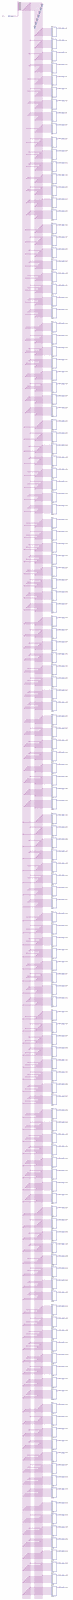
[diagram p0: schematic sheet, whole]
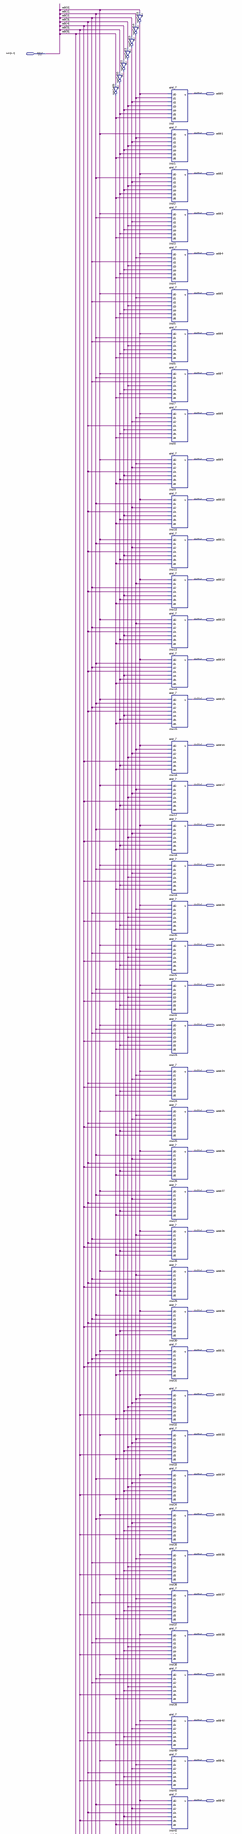
[diagram p1: schematic sheet, upper part]
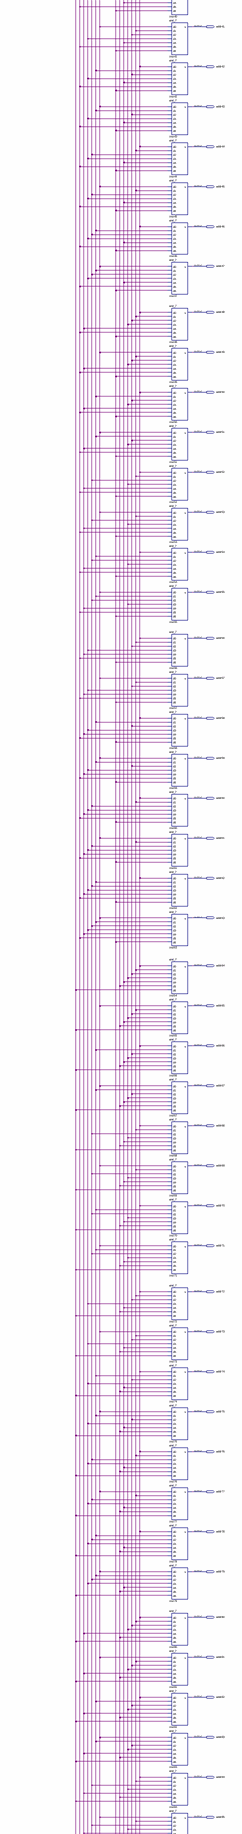
[diagram p2: schematic sheet, middle part]
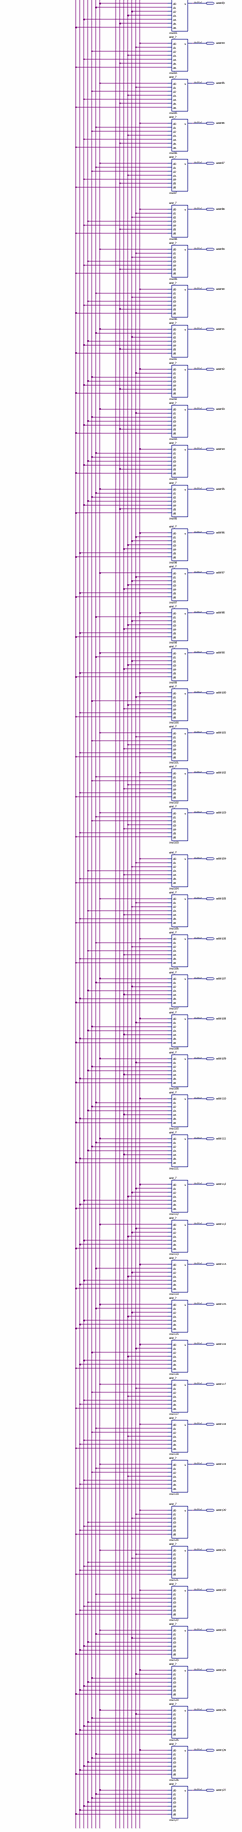
[diagram p3: schematic sheet, lower part]
// Quartus schematic ymq7.bdf as structural Verilog: 135 symbols, 129 pins
module ymq7 (
  input  [6:0] adr,
  output addr0,
  output addr1,
  output addr2,
  output addr3,
  output addr4,
  output addr5,
  output addr6,
  output addr7,
  output addr8,
  output addr9,
  output addr10,
  output addr11,
  output addr12,
  output addr13,
  output addr14,
  output addr15,
  output addr16,
  output addr17,
  output addr18,
  output addr19,
  output addr20,
  output addr21,
  output addr22,
  output addr23,
  output addr24,
  output addr25,
  output addr26,
  output addr27,
  output addr28,
  output addr29,
  output addr30,
  output addr31,
  output addr32,
  output addr33,
  output addr34,
  output addr35,
  output addr36,
  output addr37,
  output addr38,
  output addr39,
  output addr40,
  output addr41,
  output addr42,
  output addr43,
  output addr44,
  output addr45,
  output addr46,
  output addr47,
  output addr48,
  output addr49,
  output addr50,
  output addr51,
  output addr52,
  output addr53,
  output addr54,
  output addr55,
  output addr56,
  output addr57,
  output addr58,
  output addr59,
  output addr60,
  output addr61,
  output addr62,
  output addr63,
  output addr64,
  output addr65,
  output addr66,
  output addr67,
  output addr68,
  output addr69,
  output addr70,
  output addr71,
  output addr72,
  output addr73,
  output addr74,
  output addr75,
  output addr76,
  output addr77,
  output addr78,
  output addr79,
  output addr80,
  output addr81,
  output addr82,
  output addr83,
  output addr84,
  output addr85,
  output addr86,
  output addr87,
  output addr88,
  output addr89,
  output addr90,
  output addr91,
  output addr92,
  output addr93,
  output addr94,
  output addr95,
  output addr96,
  output addr97,
  output addr98,
  output addr99,
  output addr100,
  output addr101,
  output addr102,
  output addr103,
  output addr104,
  output addr105,
  output addr106,
  output addr107,
  output addr108,
  output addr109,
  output addr110,
  output addr111,
  output addr112,
  output addr113,
  output addr114,
  output addr115,
  output addr116,
  output addr117,
  output addr118,
  output addr119,
  output addr120,
  output addr121,
  output addr122,
  output addr123,
  output addr124,
  output addr125,
  output addr126,
  output addr127
);

  wire inst1409_out, inst1410_out, inst1411_out, inst1412_out, inst1413_out, inst1414_out, inst1415_out;

  not inst1410 (inst1410_out, adr[5]);
  not inst1409 (inst1409_out, adr[6]);
  not inst1414 (inst1414_out, adr[1]);
  not inst1413 (inst1413_out, adr[2]);
  not inst1412 (inst1412_out, adr[3]);
  not inst1411 (inst1411_out, adr[4]);
  not inst1415 (inst1415_out, adr[0]);
  and_7 inst (
    .d0(inst1415_out), .d1(inst1414_out), .d2(inst1413_out), .d3(inst1412_out), .d4(inst1411_out),
    .d5(inst1410_out), .d6(inst1409_out), .s(addr0));
  and_7 inst1 (
    .d0(adr[0]), .d1(inst1414_out), .d2(inst1413_out), .d3(inst1412_out), .d4(inst1411_out),
    .d5(inst1410_out), .d6(inst1409_out), .s(addr1));
  and_7 inst2 (
    .d0(inst1415_out), .d1(adr[1]), .d2(inst1413_out), .d3(inst1412_out), .d4(inst1411_out),
    .d5(inst1410_out), .d6(inst1409_out), .s(addr2));
  and_7 inst3 (
    .d0(adr[0]), .d1(adr[1]), .d2(inst1413_out), .d3(inst1412_out), .d4(inst1411_out), .d5(inst1410_out),
    .d6(inst1409_out), .s(addr3));
  and_7 inst4 (
    .d0(inst1415_out), .d1(inst1414_out), .d2(adr[2]), .d3(inst1412_out), .d4(inst1411_out),
    .d5(inst1410_out), .d6(inst1409_out), .s(addr4));
  and_7 inst5 (
    .d0(adr[0]), .d1(inst1414_out), .d2(adr[2]), .d3(inst1412_out), .d4(inst1411_out), .d5(inst1410_out),
    .d6(inst1409_out), .s(addr5));
  and_7 inst6 (
    .d0(inst1415_out), .d1(adr[1]), .d2(adr[2]), .d3(inst1412_out), .d4(inst1411_out), .d5(inst1410_out),
    .d6(inst1409_out), .s(addr6));
  and_7 inst7 (
    .d0(adr[0]), .d1(adr[1]), .d2(adr[2]), .d3(inst1412_out), .d4(inst1411_out), .d5(inst1410_out),
    .d6(inst1409_out), .s(addr7));
  and_7 inst8 (
    .d0(inst1415_out), .d1(inst1414_out), .d2(inst1413_out), .d3(adr[3]), .d4(inst1411_out),
    .d5(inst1410_out), .d6(inst1409_out), .s(addr8));
  and_7 inst9 (
    .d0(adr[0]), .d1(inst1414_out), .d2(inst1413_out), .d3(adr[3]), .d4(inst1411_out), .d5(inst1410_out),
    .d6(inst1409_out), .s(addr9));
  and_7 inst10 (
    .d0(inst1415_out), .d1(adr[1]), .d2(inst1413_out), .d3(adr[3]), .d4(inst1411_out), .d5(inst1410_out),
    .d6(inst1409_out), .s(addr10));
  and_7 inst11 (
    .d0(adr[0]), .d1(adr[1]), .d2(inst1413_out), .d3(adr[3]), .d4(inst1411_out), .d5(inst1410_out),
    .d6(inst1409_out), .s(addr11));
  and_7 inst12 (
    .d0(inst1415_out), .d1(inst1414_out), .d2(adr[2]), .d3(adr[3]), .d4(inst1411_out), .d5(inst1410_out),
    .d6(inst1409_out), .s(addr12));
  and_7 inst13 (
    .d0(adr[0]), .d1(inst1414_out), .d2(adr[2]), .d3(adr[3]), .d4(inst1411_out), .d5(inst1410_out),
    .d6(inst1409_out), .s(addr13));
  and_7 inst14 (
    .d0(inst1415_out), .d1(adr[1]), .d2(adr[2]), .d3(adr[3]), .d4(inst1411_out), .d5(inst1410_out),
    .d6(inst1409_out), .s(addr14));
  and_7 inst15 (
    .d0(adr[0]), .d1(adr[1]), .d2(adr[2]), .d3(adr[3]), .d4(inst1411_out), .d5(inst1410_out),
    .d6(inst1409_out), .s(addr15));
  and_7 inst16 (
    .d0(inst1415_out), .d1(inst1414_out), .d2(inst1413_out), .d3(inst1412_out), .d4(adr[4]),
    .d5(inst1410_out), .d6(inst1409_out), .s(addr16));
  and_7 inst17 (
    .d0(adr[0]), .d1(inst1414_out), .d2(inst1413_out), .d3(inst1412_out), .d4(adr[4]), .d5(inst1410_out),
    .d6(inst1409_out), .s(addr17));
  and_7 inst18 (
    .d0(inst1415_out), .d1(adr[1]), .d2(inst1413_out), .d3(inst1412_out), .d4(adr[4]), .d5(inst1410_out),
    .d6(inst1409_out), .s(addr18));
  and_7 inst19 (
    .d0(adr[0]), .d1(adr[1]), .d2(inst1413_out), .d3(inst1412_out), .d4(adr[4]), .d5(inst1410_out),
    .d6(inst1409_out), .s(addr19));
  and_7 inst20 (
    .d0(inst1415_out), .d1(inst1414_out), .d2(adr[2]), .d3(inst1412_out), .d4(adr[4]), .d5(inst1410_out),
    .d6(inst1409_out), .s(addr20));
  and_7 inst21 (
    .d0(adr[0]), .d1(inst1414_out), .d2(adr[2]), .d3(inst1412_out), .d4(adr[4]), .d5(inst1410_out),
    .d6(inst1409_out), .s(addr21));
  and_7 inst22 (
    .d0(inst1415_out), .d1(adr[1]), .d2(adr[2]), .d3(inst1412_out), .d4(adr[4]), .d5(inst1410_out),
    .d6(inst1409_out), .s(addr22));
  and_7 inst23 (
    .d0(adr[0]), .d1(adr[1]), .d2(adr[2]), .d3(inst1412_out), .d4(adr[4]), .d5(inst1410_out),
    .d6(inst1409_out), .s(addr23));
  and_7 inst24 (
    .d0(inst1415_out), .d1(inst1414_out), .d2(inst1413_out), .d3(adr[3]), .d4(adr[4]), .d5(inst1410_out),
    .d6(inst1409_out), .s(addr24));
  and_7 inst25 (
    .d0(adr[0]), .d1(inst1414_out), .d2(inst1413_out), .d3(adr[3]), .d4(adr[4]), .d5(inst1410_out),
    .d6(inst1409_out), .s(addr25));
  and_7 inst26 (
    .d0(inst1415_out), .d1(adr[1]), .d2(inst1413_out), .d3(adr[3]), .d4(adr[4]), .d5(inst1410_out),
    .d6(inst1409_out), .s(addr26));
  and_7 inst27 (
    .d0(adr[0]), .d1(adr[1]), .d2(inst1413_out), .d3(adr[3]), .d4(adr[4]), .d5(inst1410_out),
    .d6(inst1409_out), .s(addr27));
  and_7 inst28 (
    .d0(inst1415_out), .d1(inst1414_out), .d2(adr[2]), .d3(adr[3]), .d4(adr[4]), .d5(inst1410_out),
    .d6(inst1409_out), .s(addr28));
  and_7 inst29 (
    .d0(adr[0]), .d1(inst1414_out), .d2(adr[2]), .d3(adr[3]), .d4(adr[4]), .d5(inst1410_out),
    .d6(inst1409_out), .s(addr29));
  and_7 inst30 (
    .d0(inst1415_out), .d1(adr[1]), .d2(adr[2]), .d3(adr[3]), .d4(adr[4]), .d5(inst1410_out),
    .d6(inst1409_out), .s(addr30));
  and_7 inst31 (
    .d0(adr[0]), .d1(adr[1]), .d2(adr[2]), .d3(adr[3]), .d4(adr[4]), .d5(inst1410_out), .d6(inst1409_out),
    .s(addr31));
  and_7 inst32 (
    .d0(inst1415_out), .d1(inst1414_out), .d2(inst1413_out), .d3(inst1412_out), .d4(inst1411_out),
    .d5(adr[5]), .d6(inst1409_out), .s(addr32));
  and_7 inst33 (
    .d0(adr[0]), .d1(inst1414_out), .d2(inst1413_out), .d3(inst1412_out), .d4(inst1411_out), .d5(adr[5]),
    .d6(inst1409_out), .s(addr33));
  and_7 inst34 (
    .d0(inst1415_out), .d1(adr[1]), .d2(inst1413_out), .d3(inst1412_out), .d4(inst1411_out), .d5(adr[5]),
    .d6(inst1409_out), .s(addr34));
  and_7 inst35 (
    .d0(adr[0]), .d1(adr[1]), .d2(inst1413_out), .d3(inst1412_out), .d4(inst1411_out), .d5(adr[5]),
    .d6(inst1409_out), .s(addr35));
  and_7 inst36 (
    .d0(inst1415_out), .d1(inst1414_out), .d2(adr[2]), .d3(inst1412_out), .d4(inst1411_out), .d5(adr[5]),
    .d6(inst1409_out), .s(addr36));
  and_7 inst37 (
    .d0(adr[0]), .d1(inst1414_out), .d2(adr[2]), .d3(inst1412_out), .d4(inst1411_out), .d5(adr[5]),
    .d6(inst1409_out), .s(addr37));
  and_7 inst38 (
    .d0(inst1415_out), .d1(adr[1]), .d2(adr[2]), .d3(inst1412_out), .d4(inst1411_out), .d5(adr[5]),
    .d6(inst1409_out), .s(addr38));
  and_7 inst39 (
    .d0(adr[0]), .d1(adr[1]), .d2(adr[2]), .d3(inst1412_out), .d4(inst1411_out), .d5(adr[5]),
    .d6(inst1409_out), .s(addr39));
  and_7 inst40 (
    .d0(inst1415_out), .d1(inst1414_out), .d2(inst1413_out), .d3(adr[3]), .d4(inst1411_out), .d5(adr[5]),
    .d6(inst1409_out), .s(addr40));
  and_7 inst41 (
    .d0(adr[0]), .d1(inst1414_out), .d2(inst1413_out), .d3(adr[3]), .d4(inst1411_out), .d5(adr[5]),
    .d6(inst1409_out), .s(addr41));
  and_7 inst42 (
    .d0(inst1415_out), .d1(adr[1]), .d2(inst1413_out), .d3(adr[3]), .d4(inst1411_out), .d5(adr[5]),
    .d6(inst1409_out), .s(addr42));
  and_7 inst43 (
    .d0(adr[0]), .d1(adr[1]), .d2(inst1413_out), .d3(adr[3]), .d4(inst1411_out), .d5(adr[5]),
    .d6(inst1409_out), .s(addr43));
  and_7 inst44 (
    .d0(inst1415_out), .d1(inst1414_out), .d2(adr[2]), .d3(adr[3]), .d4(inst1411_out), .d5(adr[5]),
    .d6(inst1409_out), .s(addr44));
  and_7 inst45 (
    .d0(adr[0]), .d1(inst1414_out), .d2(adr[2]), .d3(adr[3]), .d4(inst1411_out), .d5(adr[5]),
    .d6(inst1409_out), .s(addr45));
  and_7 inst46 (
    .d0(inst1415_out), .d1(adr[1]), .d2(adr[2]), .d3(adr[3]), .d4(inst1411_out), .d5(adr[5]),
    .d6(inst1409_out), .s(addr46));
  and_7 inst47 (
    .d0(adr[0]), .d1(adr[1]), .d2(adr[2]), .d3(adr[3]), .d4(inst1411_out), .d5(adr[5]), .d6(inst1409_out),
    .s(addr47));
  and_7 inst48 (
    .d0(inst1415_out), .d1(inst1414_out), .d2(inst1413_out), .d3(inst1412_out), .d4(adr[4]), .d5(adr[5]),
    .d6(inst1409_out), .s(addr48));
  and_7 inst49 (
    .d0(adr[0]), .d1(inst1414_out), .d2(inst1413_out), .d3(inst1412_out), .d4(adr[4]), .d5(adr[5]),
    .d6(inst1409_out), .s(addr49));
  and_7 inst50 (
    .d0(inst1415_out), .d1(adr[1]), .d2(inst1413_out), .d3(inst1412_out), .d4(adr[4]), .d5(adr[5]),
    .d6(inst1409_out), .s(addr50));
  and_7 inst51 (
    .d0(adr[0]), .d1(adr[1]), .d2(inst1413_out), .d3(inst1412_out), .d4(adr[4]), .d5(adr[5]),
    .d6(inst1409_out), .s(addr51));
  and_7 inst52 (
    .d0(inst1415_out), .d1(inst1414_out), .d2(adr[2]), .d3(inst1412_out), .d4(adr[4]), .d5(adr[5]),
    .d6(inst1409_out), .s(addr52));
  and_7 inst53 (
    .d0(adr[0]), .d1(inst1414_out), .d2(adr[2]), .d3(inst1412_out), .d4(adr[4]), .d5(adr[5]),
    .d6(inst1409_out), .s(addr53));
  and_7 inst54 (
    .d0(inst1415_out), .d1(adr[1]), .d2(adr[2]), .d3(inst1412_out), .d4(adr[4]), .d5(adr[5]),
    .d6(inst1409_out), .s(addr54));
  and_7 inst55 (
    .d0(adr[0]), .d1(adr[1]), .d2(adr[2]), .d3(inst1412_out), .d4(adr[4]), .d5(adr[5]), .d6(inst1409_out),
    .s(addr55));
  and_7 inst56 (
    .d0(inst1415_out), .d1(inst1414_out), .d2(inst1413_out), .d3(adr[3]), .d4(adr[4]), .d5(adr[5]),
    .d6(inst1409_out), .s(addr56));
  and_7 inst57 (
    .d0(adr[0]), .d1(inst1414_out), .d2(inst1413_out), .d3(adr[3]), .d4(adr[4]), .d5(adr[5]),
    .d6(inst1409_out), .s(addr57));
  and_7 inst58 (
    .d0(inst1415_out), .d1(adr[1]), .d2(inst1413_out), .d3(adr[3]), .d4(adr[4]), .d5(adr[5]),
    .d6(inst1409_out), .s(addr58));
  and_7 inst59 (
    .d0(adr[0]), .d1(adr[1]), .d2(inst1413_out), .d3(adr[3]), .d4(adr[4]), .d5(adr[5]), .d6(inst1409_out),
    .s(addr59));
  and_7 inst60 (
    .d0(inst1415_out), .d1(inst1414_out), .d2(adr[2]), .d3(adr[3]), .d4(adr[4]), .d5(adr[5]),
    .d6(inst1409_out), .s(addr60));
  and_7 inst61 (
    .d0(adr[0]), .d1(inst1414_out), .d2(adr[2]), .d3(adr[3]), .d4(adr[4]), .d5(adr[5]), .d6(inst1409_out),
    .s(addr61));
  and_7 inst62 (
    .d0(inst1415_out), .d1(adr[1]), .d2(adr[2]), .d3(adr[3]), .d4(adr[4]), .d5(adr[5]), .d6(inst1409_out),
    .s(addr62));
  and_7 inst63 (
    .d0(adr[0]), .d1(adr[1]), .d2(adr[2]), .d3(adr[3]), .d4(adr[4]), .d5(adr[5]), .d6(inst1409_out),
    .s(addr63));
  and_7 inst64 (
    .d0(inst1415_out), .d1(inst1414_out), .d2(inst1413_out), .d3(inst1412_out), .d4(inst1411_out),
    .d5(inst1410_out), .d6(adr[6]), .s(addr64));
  and_7 inst65 (
    .d0(adr[0]), .d1(inst1414_out), .d2(inst1413_out), .d3(inst1412_out), .d4(inst1411_out),
    .d5(inst1410_out), .d6(adr[6]), .s(addr65));
  and_7 inst66 (
    .d0(inst1415_out), .d1(adr[1]), .d2(inst1413_out), .d3(inst1412_out), .d4(inst1411_out),
    .d5(inst1410_out), .d6(adr[6]), .s(addr66));
  and_7 inst67 (
    .d0(adr[0]), .d1(adr[1]), .d2(inst1413_out), .d3(inst1412_out), .d4(inst1411_out), .d5(inst1410_out),
    .d6(adr[6]), .s(addr67));
  and_7 inst68 (
    .d0(inst1415_out), .d1(inst1414_out), .d2(adr[2]), .d3(inst1412_out), .d4(inst1411_out),
    .d5(inst1410_out), .d6(adr[6]), .s(addr68));
  and_7 inst69 (
    .d0(adr[0]), .d1(inst1414_out), .d2(adr[2]), .d3(inst1412_out), .d4(inst1411_out), .d5(inst1410_out),
    .d6(adr[6]), .s(addr69));
  and_7 inst70 (
    .d0(inst1415_out), .d1(adr[1]), .d2(adr[2]), .d3(inst1412_out), .d4(inst1411_out), .d5(inst1410_out),
    .d6(adr[6]), .s(addr70));
  and_7 inst71 (
    .d0(adr[0]), .d1(adr[1]), .d2(adr[2]), .d3(inst1412_out), .d4(inst1411_out), .d5(inst1410_out),
    .d6(adr[6]), .s(addr71));
  and_7 inst72 (
    .d0(inst1415_out), .d1(inst1414_out), .d2(inst1413_out), .d3(adr[3]), .d4(inst1411_out),
    .d5(inst1410_out), .d6(adr[6]), .s(addr72));
  and_7 inst73 (
    .d0(adr[0]), .d1(inst1414_out), .d2(inst1413_out), .d3(adr[3]), .d4(inst1411_out), .d5(inst1410_out),
    .d6(adr[6]), .s(addr73));
  and_7 inst74 (
    .d0(inst1415_out), .d1(adr[1]), .d2(inst1413_out), .d3(adr[3]), .d4(inst1411_out), .d5(inst1410_out),
    .d6(adr[6]), .s(addr74));
  and_7 inst75 (
    .d0(adr[0]), .d1(adr[1]), .d2(inst1413_out), .d3(adr[3]), .d4(inst1411_out), .d5(inst1410_out),
    .d6(adr[6]), .s(addr75));
  and_7 inst76 (
    .d0(inst1415_out), .d1(inst1414_out), .d2(adr[2]), .d3(adr[3]), .d4(inst1411_out), .d5(inst1410_out),
    .d6(adr[6]), .s(addr76));
  and_7 inst77 (
    .d0(adr[0]), .d1(inst1414_out), .d2(adr[2]), .d3(adr[3]), .d4(inst1411_out), .d5(inst1410_out),
    .d6(adr[6]), .s(addr77));
  and_7 inst78 (
    .d0(inst1415_out), .d1(adr[1]), .d2(adr[2]), .d3(adr[3]), .d4(inst1411_out), .d5(inst1410_out),
    .d6(adr[6]), .s(addr78));
  and_7 inst79 (
    .d0(adr[0]), .d1(adr[1]), .d2(adr[2]), .d3(adr[3]), .d4(inst1411_out), .d5(inst1410_out), .d6(adr[6]),
    .s(addr79));
  and_7 inst80 (
    .d0(inst1415_out), .d1(inst1414_out), .d2(inst1413_out), .d3(inst1412_out), .d4(adr[4]),
    .d5(inst1410_out), .d6(adr[6]), .s(addr80));
  and_7 inst81 (
    .d0(adr[0]), .d1(inst1414_out), .d2(inst1413_out), .d3(inst1412_out), .d4(adr[4]), .d5(inst1410_out),
    .d6(adr[6]), .s(addr81));
  and_7 inst82 (
    .d0(inst1415_out), .d1(adr[1]), .d2(inst1413_out), .d3(inst1412_out), .d4(adr[4]), .d5(inst1410_out),
    .d6(adr[6]), .s(addr82));
  and_7 inst83 (
    .d0(adr[0]), .d1(adr[1]), .d2(inst1413_out), .d3(inst1412_out), .d4(adr[4]), .d5(inst1410_out),
    .d6(adr[6]), .s(addr83));
  and_7 inst84 (
    .d0(inst1415_out), .d1(inst1414_out), .d2(adr[2]), .d3(inst1412_out), .d4(adr[4]), .d5(inst1410_out),
    .d6(adr[6]), .s(addr84));
  and_7 inst85 (
    .d0(adr[0]), .d1(inst1414_out), .d2(adr[2]), .d3(inst1412_out), .d4(adr[4]), .d5(inst1410_out),
    .d6(adr[6]), .s(addr85));
  and_7 inst86 (
    .d0(inst1415_out), .d1(adr[1]), .d2(adr[2]), .d3(inst1412_out), .d4(adr[4]), .d5(inst1410_out),
    .d6(adr[6]), .s(addr86));
  and_7 inst87 (
    .d0(adr[0]), .d1(adr[1]), .d2(adr[2]), .d3(inst1412_out), .d4(adr[4]), .d5(inst1410_out), .d6(adr[6]),
    .s(addr87));
  and_7 inst88 (
    .d0(inst1415_out), .d1(inst1414_out), .d2(inst1413_out), .d3(adr[3]), .d4(adr[4]), .d5(inst1410_out),
    .d6(adr[6]), .s(addr88));
  and_7 inst89 (
    .d0(adr[0]), .d1(inst1414_out), .d2(inst1413_out), .d3(adr[3]), .d4(adr[4]), .d5(inst1410_out),
    .d6(adr[6]), .s(addr89));
  and_7 inst90 (
    .d0(inst1415_out), .d1(adr[1]), .d2(inst1413_out), .d3(adr[3]), .d4(adr[4]), .d5(inst1410_out),
    .d6(adr[6]), .s(addr90));
  and_7 inst91 (
    .d0(adr[0]), .d1(adr[1]), .d2(inst1413_out), .d3(adr[3]), .d4(adr[4]), .d5(inst1410_out), .d6(adr[6]),
    .s(addr91));
  and_7 inst92 (
    .d0(inst1415_out), .d1(inst1414_out), .d2(adr[2]), .d3(adr[3]), .d4(adr[4]), .d5(inst1410_out),
    .d6(adr[6]), .s(addr92));
  and_7 inst93 (
    .d0(adr[0]), .d1(inst1414_out), .d2(adr[2]), .d3(adr[3]), .d4(adr[4]), .d5(inst1410_out), .d6(adr[6]),
    .s(addr93));
  and_7 inst94 (
    .d0(inst1415_out), .d1(adr[1]), .d2(adr[2]), .d3(adr[3]), .d4(adr[4]), .d5(inst1410_out), .d6(adr[6]),
    .s(addr94));
  and_7 inst95 (
    .d0(adr[0]), .d1(adr[1]), .d2(adr[2]), .d3(adr[3]), .d4(adr[4]), .d5(inst1410_out), .d6(adr[6]),
    .s(addr95));
  and_7 inst96 (
    .d0(inst1415_out), .d1(inst1414_out), .d2(inst1413_out), .d3(inst1412_out), .d4(inst1411_out),
    .d5(adr[5]), .d6(adr[6]), .s(addr96));
  and_7 inst97 (
    .d0(adr[0]), .d1(inst1414_out), .d2(inst1413_out), .d3(inst1412_out), .d4(inst1411_out), .d5(adr[5]),
    .d6(adr[6]), .s(addr97));
  and_7 inst98 (
    .d0(inst1415_out), .d1(adr[1]), .d2(inst1413_out), .d3(inst1412_out), .d4(inst1411_out), .d5(adr[5]),
    .d6(adr[6]), .s(addr98));
  and_7 inst99 (
    .d0(adr[0]), .d1(adr[1]), .d2(inst1413_out), .d3(inst1412_out), .d4(inst1411_out), .d5(adr[5]),
    .d6(adr[6]), .s(addr99));
  and_7 inst100 (
    .d0(inst1415_out), .d1(inst1414_out), .d2(adr[2]), .d3(inst1412_out), .d4(inst1411_out), .d5(adr[5]),
    .d6(adr[6]), .s(addr100));
  and_7 inst101 (
    .d0(adr[0]), .d1(inst1414_out), .d2(adr[2]), .d3(inst1412_out), .d4(inst1411_out), .d5(adr[5]),
    .d6(adr[6]), .s(addr101));
  and_7 inst102 (
    .d0(inst1415_out), .d1(adr[1]), .d2(adr[2]), .d3(inst1412_out), .d4(inst1411_out), .d5(adr[5]),
    .d6(adr[6]), .s(addr102));
  and_7 inst103 (
    .d0(adr[0]), .d1(adr[1]), .d2(adr[2]), .d3(inst1412_out), .d4(inst1411_out), .d5(adr[5]), .d6(adr[6]),
    .s(addr103));
  and_7 inst104 (
    .d0(inst1415_out), .d1(inst1414_out), .d2(inst1413_out), .d3(adr[3]), .d4(inst1411_out), .d5(adr[5]),
    .d6(adr[6]), .s(addr104));
  and_7 inst105 (
    .d0(adr[0]), .d1(inst1414_out), .d2(inst1413_out), .d3(adr[3]), .d4(inst1411_out), .d5(adr[5]),
    .d6(adr[6]), .s(addr105));
  and_7 inst106 (
    .d0(inst1415_out), .d1(adr[1]), .d2(inst1413_out), .d3(adr[3]), .d4(inst1411_out), .d5(adr[5]),
    .d6(adr[6]), .s(addr106));
  and_7 inst107 (
    .d0(adr[0]), .d1(adr[1]), .d2(inst1413_out), .d3(adr[3]), .d4(inst1411_out), .d5(adr[5]), .d6(adr[6]),
    .s(addr107));
  and_7 inst108 (
    .d0(inst1415_out), .d1(inst1414_out), .d2(adr[2]), .d3(adr[3]), .d4(inst1411_out), .d5(adr[5]),
    .d6(adr[6]), .s(addr108));
  and_7 inst109 (
    .d0(adr[0]), .d1(inst1414_out), .d2(adr[2]), .d3(adr[3]), .d4(inst1411_out), .d5(adr[5]), .d6(adr[6]),
    .s(addr109));
  and_7 inst110 (
    .d0(inst1415_out), .d1(adr[1]), .d2(adr[2]), .d3(adr[3]), .d4(inst1411_out), .d5(adr[5]), .d6(adr[6]),
    .s(addr110));
  and_7 inst111 (
    .d0(adr[0]), .d1(adr[1]), .d2(adr[2]), .d3(adr[3]), .d4(inst1411_out), .d5(adr[5]), .d6(adr[6]),
    .s(addr111));
  and_7 inst112 (
    .d0(inst1415_out), .d1(inst1414_out), .d2(inst1413_out), .d3(inst1412_out), .d4(adr[4]), .d5(adr[5]),
    .d6(adr[6]), .s(addr112));
  and_7 inst113 (
    .d0(adr[0]), .d1(inst1414_out), .d2(inst1413_out), .d3(inst1412_out), .d4(adr[4]), .d5(adr[5]),
    .d6(adr[6]), .s(addr113));
  and_7 inst114 (
    .d0(inst1415_out), .d1(adr[1]), .d2(inst1413_out), .d3(inst1412_out), .d4(adr[4]), .d5(adr[5]),
    .d6(adr[6]), .s(addr114));
  and_7 inst115 (
    .d0(adr[0]), .d1(adr[1]), .d2(inst1413_out), .d3(inst1412_out), .d4(adr[4]), .d5(adr[5]), .d6(adr[6]),
    .s(addr115));
  and_7 inst116 (
    .d0(inst1415_out), .d1(inst1414_out), .d2(adr[2]), .d3(inst1412_out), .d4(adr[4]), .d5(adr[5]),
    .d6(adr[6]), .s(addr116));
  and_7 inst117 (
    .d0(adr[0]), .d1(inst1414_out), .d2(adr[2]), .d3(inst1412_out), .d4(adr[4]), .d5(adr[5]), .d6(adr[6]),
    .s(addr117));
  and_7 inst118 (
    .d0(inst1415_out), .d1(adr[1]), .d2(adr[2]), .d3(inst1412_out), .d4(adr[4]), .d5(adr[5]), .d6(adr[6]),
    .s(addr118));
  and_7 inst119 (
    .d0(adr[0]), .d1(adr[1]), .d2(adr[2]), .d3(inst1412_out), .d4(adr[4]), .d5(adr[5]), .d6(adr[6]),
    .s(addr119));
  and_7 inst120 (
    .d0(inst1415_out), .d1(inst1414_out), .d2(inst1413_out), .d3(adr[3]), .d4(adr[4]), .d5(adr[5]),
    .d6(adr[6]), .s(addr120));
  and_7 inst121 (
    .d0(adr[0]), .d1(inst1414_out), .d2(inst1413_out), .d3(adr[3]), .d4(adr[4]), .d5(adr[5]), .d6(adr[6]),
    .s(addr121));
  and_7 inst122 (
    .d0(inst1415_out), .d1(adr[1]), .d2(inst1413_out), .d3(adr[3]), .d4(adr[4]), .d5(adr[5]), .d6(adr[6]),
    .s(addr122));
  and_7 inst123 (
    .d0(adr[0]), .d1(adr[1]), .d2(inst1413_out), .d3(adr[3]), .d4(adr[4]), .d5(adr[5]), .d6(adr[6]),
    .s(addr123));
  and_7 inst124 (
    .d0(inst1415_out), .d1(inst1414_out), .d2(adr[2]), .d3(adr[3]), .d4(adr[4]), .d5(adr[5]), .d6(adr[6]),
    .s(addr124));
  and_7 inst125 (
    .d0(adr[0]), .d1(inst1414_out), .d2(adr[2]), .d3(adr[3]), .d4(adr[4]), .d5(adr[5]), .d6(adr[6]),
    .s(addr125));
  and_7 inst126 (
    .d0(inst1415_out), .d1(adr[1]), .d2(adr[2]), .d3(adr[3]), .d4(adr[4]), .d5(adr[5]), .d6(adr[6]),
    .s(addr126));
  and_7 inst127 (
    .d0(adr[0]), .d1(adr[1]), .d2(adr[2]), .d3(adr[3]), .d4(adr[4]), .d5(adr[5]), .d6(adr[6]), .s(addr127));
endmodule
